# Altium schematic sheet ADC.SchDoc: ADC
size A3; DocumentNumber: 2; SheetNumber: 2; SheetTotal: 12
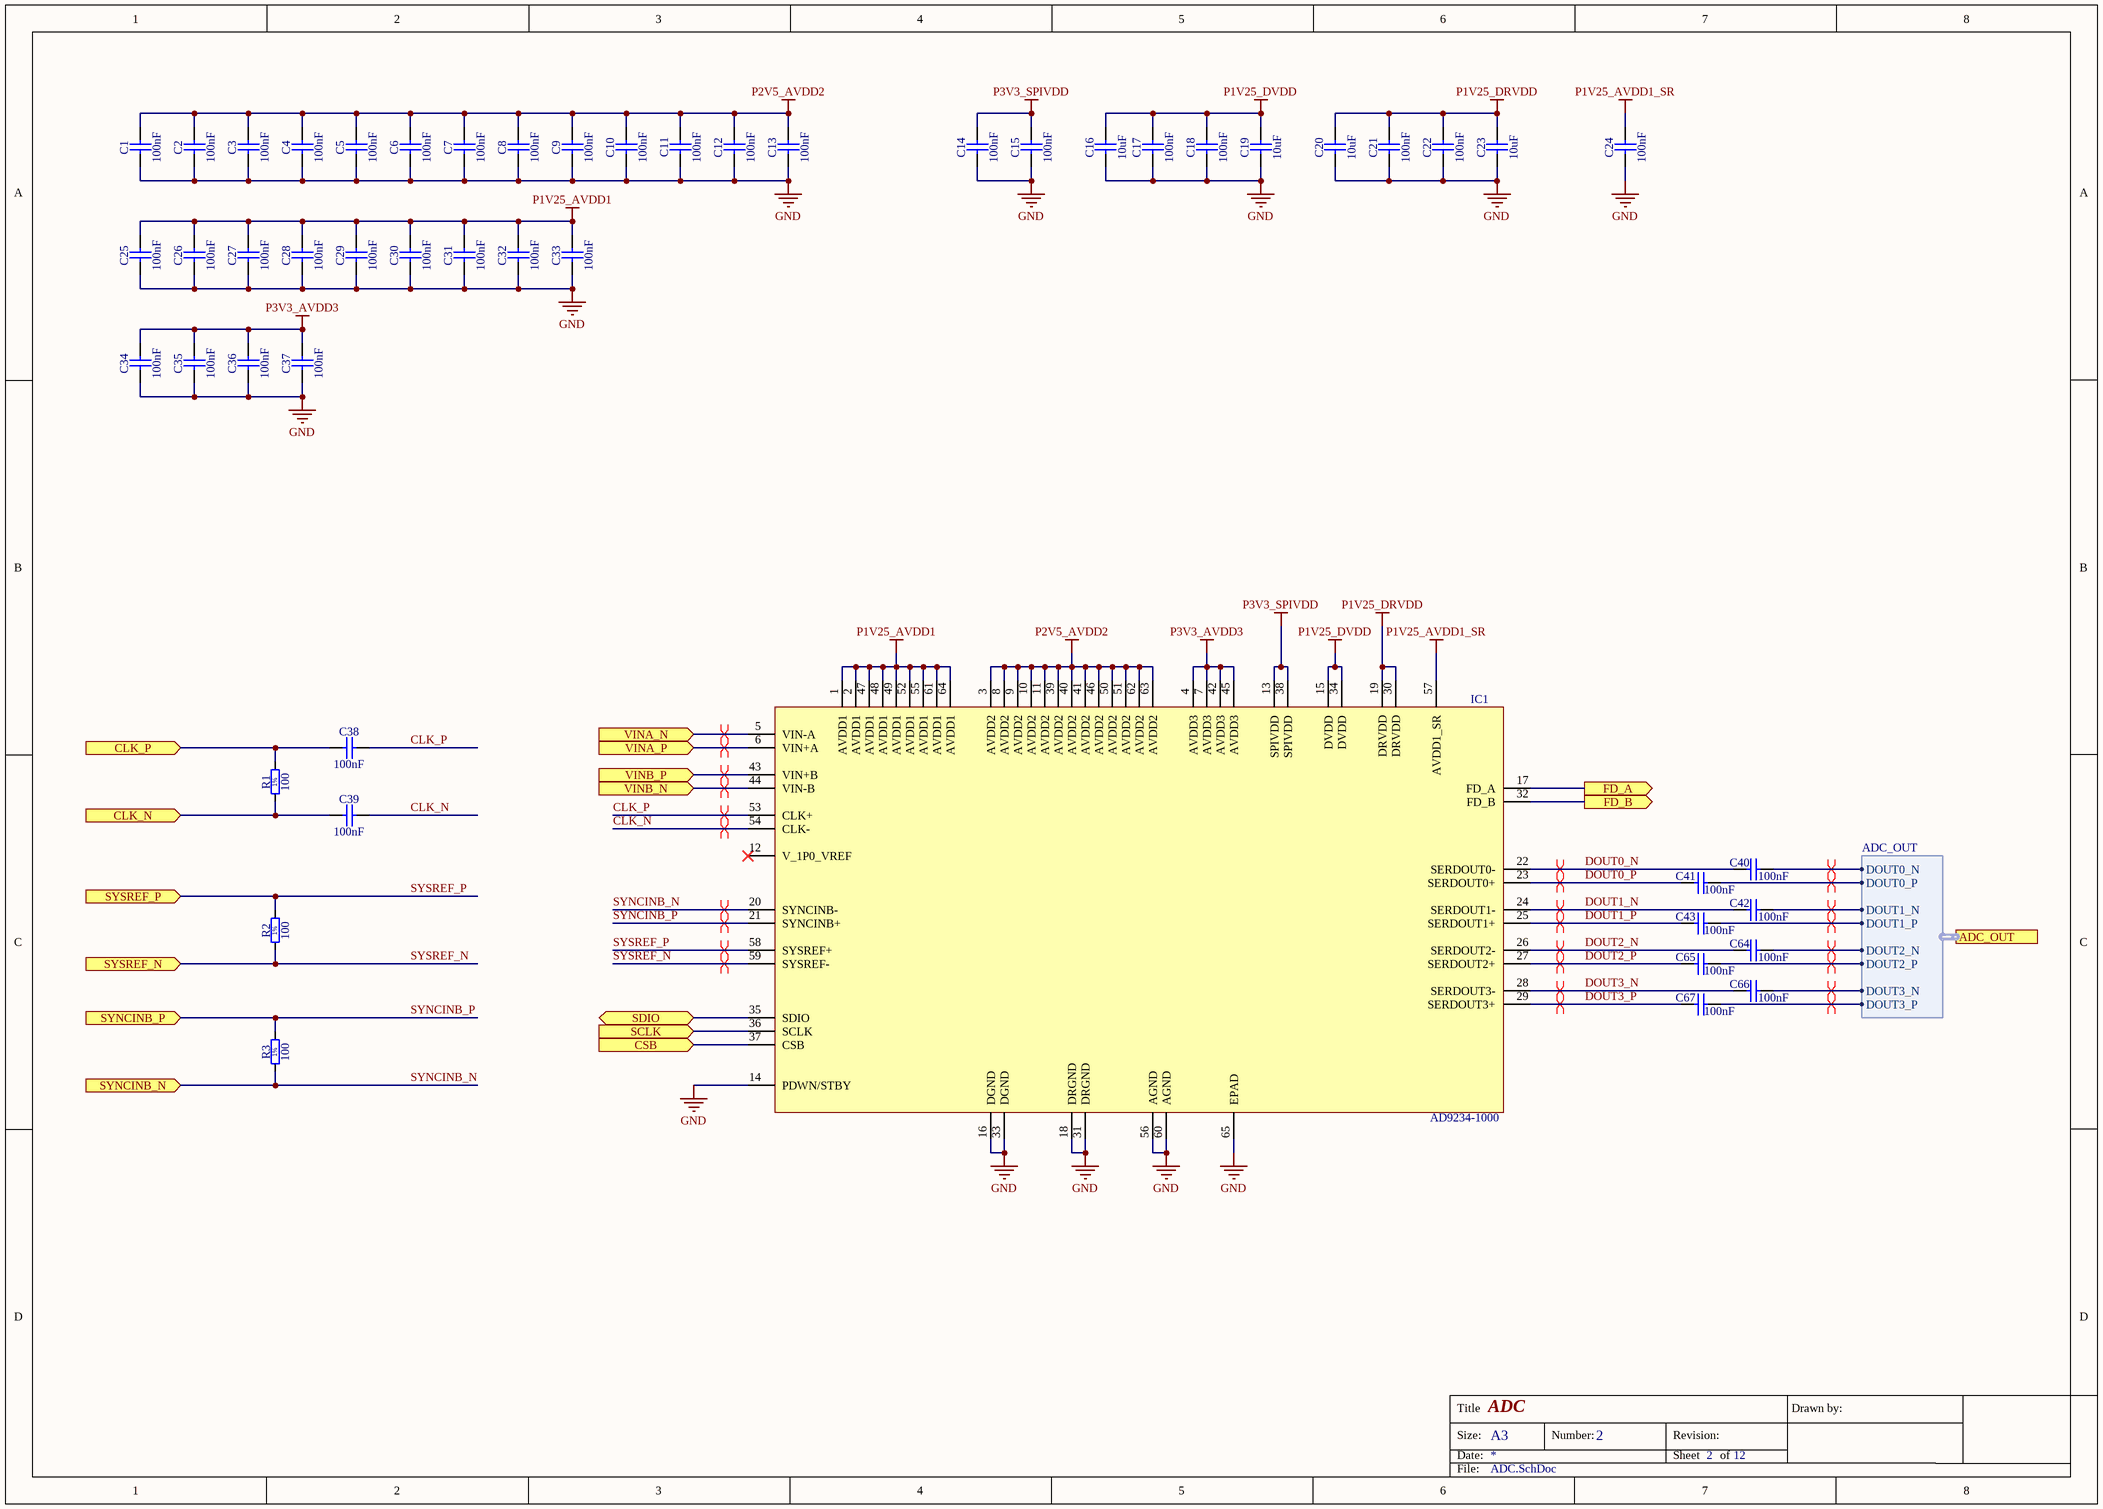
[diagram p0: ADC.SchDoc]

## Parts
C1  100nF  [CAPC0603X33N]
C2  100nF  [CAPC0603X33N]
C3  100nF  [CAPC0603X33N]
C4  100nF  [CAPC0603X33N]
C5  100nF  [CAPC0603X33N]
C6  100nF  [CAPC0603X33N]
C7  100nF  [CAPC0603X33N]
C8  100nF  [CAPC0603X33N]
C9  100nF  [CAPC0603X33N]
C10  100nF  [CAPC0603X33N]
C11  100nF  [CAPC0603X33N]
C12  100nF  [CAPC0603X33N]
C13  100nF  [CAPC0603X33N]
C14  100nF  [CAPC0603X33N]
C15  100nF  [CAPC0603X33N]
C16  10uF  [CAPC1608X87N]
C17  100nF  [CAPC0603X33N]
C18  100nF  [CAPC0603X33N]
C19  10uF  [CAPC1608X87N]
C20  10uF  [CAPC1608X87N]
C21  100nF  [CAPC0603X33N]
C22  100nF  [CAPC0603X33N]
C23  10uF  [CAPC1608X87N]
C24  100nF  [CAPC0603X33N]
C25  100nF  [CAPC0603X33N]
C26  100nF  [CAPC0603X33N]
C27  100nF  [CAPC0603X33N]
C28  100nF  [CAPC0603X33N]
C29  100nF  [CAPC0603X33N]
C30  100nF  [CAPC0603X33N]
C31  100nF  [CAPC0603X33N]
C32  100nF  [CAPC0603X33N]
C33  100nF  [CAPC0603X33N]
C34  100nF  [CAPC0603X33N]
C35  100nF  [CAPC0603X33N]
C36  100nF  [CAPC0603X33N]
C37  100nF  [CAPC0603X33N]
C38  100nF  [CAPC0603X33N]
C39  100nF  [CAPC0603X33N]
C40  100nF  [CAPC0603X33N]
C41  100nF  [CAPC0603X33N]
C42  100nF  [CAPC0603X33N]
C43  100nF  [CAPC0603X33N]
C64  100nF  [CAPC0603X33N]
C65  100nF  [CAPC0603X33N]
C66  100nF  [CAPC0603X33N]
C67  100nF  [CAPC0603X33N]
IC1  AD9234-1000  [CP_64_15]
R1  100  [RESC1005X40N]
R2  100  [RESC1005X40N]
R3  100  [RESC1005X40N]

## Ports
ADC_OUT (harness ADC_OUT), CLK_N (in), CLK_P (in), CSB (in), FD_A (out), FD_B (out), SCLK (in), SDIO (bidir), SYNCINB_N (in), SYNCINB_P (in), SYSREF_N (in), SYSREF_P (in), VINA_N (in), VINA_P (in), VINB_N (in), VINB_P (in)

## Harnesses
ADC_OUT: DOUT0_N, DOUT0_P, DOUT1_N, DOUT1_P, DOUT2_N, DOUT2_P, DOUT3_N, DOUT3_P

## Nets
GND: C1.1 C2.1 C3.1 C4.1 C5.1 C6.1 C7.1 C8.1 C9.1 C10.1 C11.1 C12.1 C13.1 C14.1 C15.1 C16.1 C17.1 C18.1 C19.1 C20.1 C21.1 C22.1 C23.1 C24.1 C25.1 C26.1 C27.1 C28.1 C29.1 C30.1 C31.1 C32.1 C33.1 C34.1 C35.1 C36.1 C37.1 IC1.14(PDWN/STBY) IC1.16(DGND) IC1.18(DRGND) IC1.31(DRGND) IC1.33(DGND) IC1.56(AGND) IC1.60(AGND) IC1.65(EPAD)
P1V25_AVDD1: C25.2 C26.2 C27.2 C28.2 C29.2 C30.2 C31.2 C32.2 C33.2 IC1.1(AVDD1) IC1.2(AVDD1) IC1.47(AVDD1) IC1.48(AVDD1) IC1.49(AVDD1) IC1.52(AVDD1) IC1.55(AVDD1) IC1.61(AVDD1) IC1.64(AVDD1)
P1V25_AVDD1_SR: C24.2 IC1.57(AVDD1_SR)
P1V25_DRVDD: C20.2 C21.2 C22.2 C23.2 IC1.19(DRVDD) IC1.30(DRVDD)
P1V25_DVDD: C16.2 C17.2 C18.2 C19.2 IC1.15(DVDD) IC1.34(DVDD)
P2V5_AVDD2: C1.2 C2.2 C3.2 C4.2 C5.2 C6.2 C7.2 C8.2 C9.2 C10.2 C11.2 C12.2 C13.2 IC1.3(AVDD2) IC1.8(AVDD2) IC1.9(AVDD2) IC1.10(AVDD2) IC1.11(AVDD2) IC1.39(AVDD2) IC1.40(AVDD2) IC1.41(AVDD2) IC1.46(AVDD2) IC1.50(AVDD2) IC1.51(AVDD2) IC1.62(AVDD2) IC1.63(AVDD2)
P3V3_AVDD3: C34.2 C35.2 C36.2 C37.2 IC1.4(AVDD3) IC1.7(AVDD3) IC1.42(AVDD3) IC1.45(AVDD3)
P3V3_SPIVDD: C14.2 C15.2 IC1.13(SPIVDD) IC1.38(SPIVDD)
CLK_N: C39.2 IC1.54(CLK-)
CLK_N: C39.1 R1.1 ; port CLK_N  [a separate net that carries the same name]
CLK_P: C38.2 IC1.53(CLK+)
CLK_P: C38.1 R1.2 ; port CLK_P  [a separate net that carries the same name]
CSB: IC1.37(CSB) ; port CSB
DOUT0_N: C40.1 IC1.22(SERDOUT0-)
DOUT0_P: C41.1 IC1.23(SERDOUT0+)
DOUT1_N: C42.1 IC1.24(SERDOUT1-)
DOUT1_P: C43.1 IC1.25(SERDOUT1+)
DOUT2_N: C64.1 IC1.26(SERDOUT2-)
DOUT2_P: C65.1 IC1.27(SERDOUT2+)
DOUT3_N: C66.1 IC1.28(SERDOUT3-)
DOUT3_P: C67.1 IC1.29(SERDOUT3+)
FD_A: IC1.17(FD_A) ; port FD_A
FD_B: IC1.32(FD_B) ; port FD_B
SCLK: IC1.36(SCLK) ; port SCLK
SDIO: IC1.35(SDIO) ; port SDIO
SYNCINB_N: IC1.20(SYNCINB-) R3.1 ; port SYNCINB_N
SYNCINB_P: IC1.21(SYNCINB+) R3.2 ; port SYNCINB_P
SYSREF_N: IC1.59(SYSREF-) R2.1 ; port SYSREF_N
SYSREF_P: IC1.58(SYSREF+) R2.2 ; port SYSREF_P
VINA_N: IC1.5(VIN-A) ; port VINA_N
VINA_P: IC1.6(VIN+A) ; port VINA_P
VINB_N: IC1.44(VIN-B) ; port VINB_N
VINB_P: IC1.43(VIN+B) ; port VINB_P
NetC40_2: C40.2 ; port ADC_OUT.DOUT0_N
NetC41_2: C41.2 ; port ADC_OUT.DOUT0_P
NetC42_2: C42.2 ; port ADC_OUT.DOUT1_N
NetC43_2: C43.2 ; port ADC_OUT.DOUT1_P
NetC64_2: C64.2 ; port ADC_OUT.DOUT2_N
NetC65_2: C65.2 ; port ADC_OUT.DOUT2_P
NetC66_2: C66.2 ; port ADC_OUT.DOUT3_N
NetC67_2: C67.2 ; port ADC_OUT.DOUT3_P

Not connected (* = marked no-connect by the designer): IC1 12(V_1P0_VREF)*

## Layout directives
differential pair: CLK_N, CLK_P, DOUT0_N, DOUT0_P, DOUT1_N, DOUT1_P, DOUT2_N, DOUT2_P, DOUT3_N, DOUT3_P, NetC40_2, NetC41_2, NetC42_2, NetC43_2, NetC64_2, NetC65_2, NetC66_2, NetC67_2, SYNCINB_N, SYNCINB_P, SYSREF_N, SYSREF_P, VINA_N, VINA_P, VINB_N, VINB_P

## Notes on the sheet
- Title
- Size:
- Date:
- A3
- Number:
- Revision:
- Sheet
- of
- Drawn by:
- File:
- (in symbol R0402_100R_1%_0.0625W_100PPM) 1%

## Library data of the parts
C1-C15 C17 C18 C21 C22 C24-C43 C64-C67 = CC0201_100NF_6.3V_10%_X5R: Non-polarised capacitor; Part Description: SMD Multilayer Chip Ceramic Capacitor; Manufacturer: GENERIC; Manufacturer1 Part Number: 02016D104KAT2A; Tolerance: ±10%; Voltage: 6.3V; TC: X5R; Value: 100nF; Part Number: CC0201_100NF_6.3V_10%_X5R; Component Kind: Standard; Component Type: Standard; Pin Count: 2; Status: Not Recommended; Manufacturer Part Number: CC0201_100NF_6.3V_10%_X5R; Case: 0201; Mounted: Yes; Socket: No; SMD: Yes; Sense: No; Manufacturer1 Example: AVX; Manufacturer1 ComponentHeight: 0.33mm; HelpURL: \\cern.ch\dfs\Applications\Altium\Datasheets\CC0201_X5R_AVX.pdf; Author: CERN DEM JLC; CreateDate: 03.12.2007; LatestRevisionDate: 03.12.2007
C16 C19 C20 C23 = CC0603_10UF_6.3V_20%_X5R: Non-polarised capacitor; Part Description: SMD Multilayer Chip Ceramic Capacitor; Manufacturer: GENERIC; Manufacturer1 Part Number: C0603C106M9PAC; Voltage: 6.3V; TC: X5R; Tolerance: ±20%; Part Number: CC0603_10UF_6.3V_20%_X5R; Component Kind: Standard; Component Type: Standard; Pin Count: 2; Value: 10uF; Status: Preferred; Manufacturer Part Number: CC0603_10uF_6.3V_20%_X5R; Case: 0603; Mounted: Yes; Socket: No; SMD: Yes; Sense: No; Manufacturer1 Example: KEMET; Manufacturer1 ComponentHeight: 0.95mm; HelpURL: \\cern.ch\dfs\Applications\Altium\Datasheets\CC0603_X5R_KEMET.pdf; Author: CERN DEM JLC; CreateDate: 03.12.2007; LatestRevisionDate: 03.12.2007
IC1 = AD9234-1000: 12-Bit, 1 GSPS/500 MSPS JESD204B, Dual Analog-to-Digital Converter; Manufacturer: Analog Devices Inc; Manufacturer Part Number: AD9234BCPZ-1000
R1-R3 = R0402_100R_1%_0.0625W_100PPM: Resistor - 1%; Part Description: General Purpose Thick Film Chip Resistor; Manufacturer: GENERIC; Manufacturer1 Part Number: 232270671001L; TC: ±100ppm/°C; Part Number: R0402_100R_1%_0.0625W_100PPM; Component Kind: Standard; Component Type: Standard; Pin Count: 2; Value: 100; Status: Not recommended; Power: 0.0625W; Tolerance: ±1%; Manufacturer Part Number: R0402_100R_1%_0.0625W_100PPM; Case: 0402; Mounted: Yes; Socket: No; SMD: Yes; Manufacturer1 Example: YAGEO PHYCOMP; Manufacturer1 ComponentHeight: 0.4mm; HelpURL: \\cern.ch\dfs\Applications\Altium\Datasheets\R0402_Phycomp_RC0402.pdf; Author: CERN DEM JLC; CreateDate: 03.12.2007; LatestRevisionDate: 17.10.2012; Sense: No